# Altium schematic sheet DAC.SchDoc
size A4
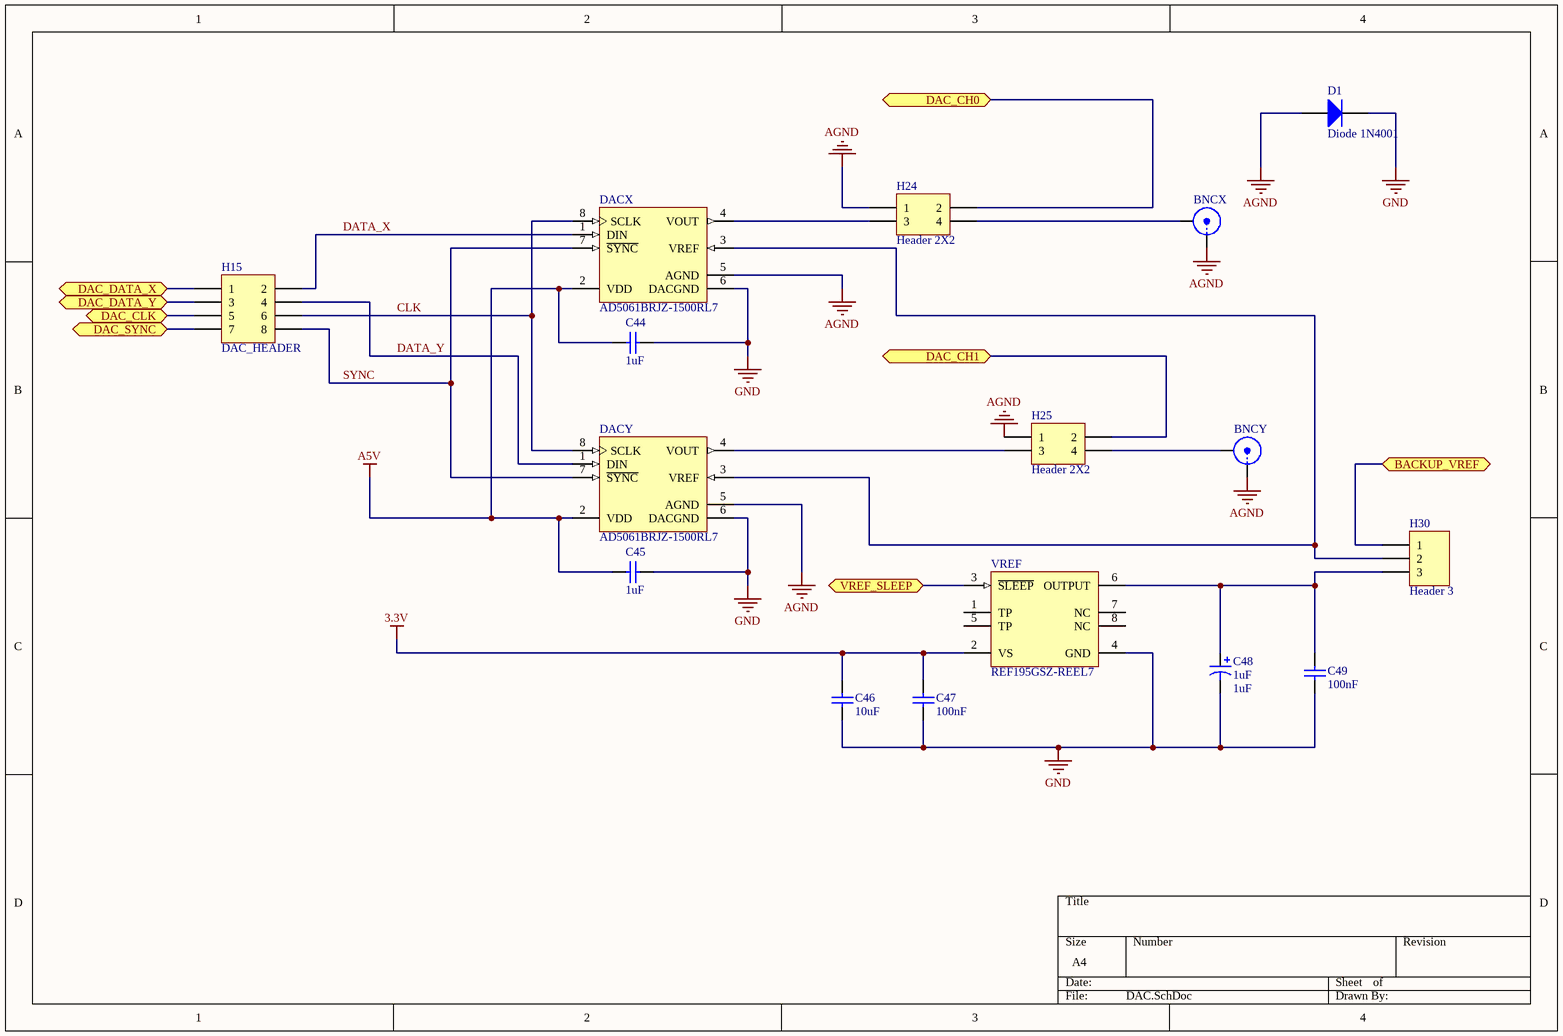
[diagram p0: DAC.SchDoc]

## Parts
BNCX  BNC  [BNC_RA CON]  (value not drawn)
BNCY  BNC  [BNC_RA CON]  (value not drawn)
C44  1uF  [CAPC0603(1608)100_M]
C45  1uF  [CAPC0603(1608)100_M]
C46  10uF  [CAPC0603(1608)100_M]
C47  100nF  [CAPC0603(1608)100_M]
C48  1uF  [C0805]
C49  100nF  [CAPC0603(1608)100_M]
D1  Diode 1N4001  [DO-41]
DACX  AD5061BRJZ-1500RL7  [RJ-8_N]
DACY  AD5061BRJZ-1500RL7  [RJ-8_N]
H15  DAC_HEADER  [HDR2X4]
H24  Header 2X2  [HDR2X2]
H25  Header 2X2  [HDR2X2]
H30  Header 3  [HDR1X3]
VREF  REF195GSZ-REEL7  [ADI-R-8_N]

## Ports
BACKUP_VREF, DAC_CH0, DAC_CH1, DAC_CLK, DAC_DATA_X, DAC_DATA_Y, DAC_SYNC, VREF_SLEEP

## Nets
3.3V: C46.2 C47.2 VREF.2(VS)
A5V: C44.1 C45.1 DACX.2(VDD) DACY.2(VDD)
AGND: BNCX.1(X) BNCY.1(X) D1.1(A) DACX.5(AGND) DACY.5(AGND) H24.1 H25.1
GND: C44.2 C45.2 C46.1 C47.1 C48.2 C49.1 D1.2(K) DACX.6(DACGND) DACY.6(DACGND) VREF.4(GND)
BACKUP_VREF: H30.1 ; port BACKUP_VREF
CLK: DACX.8(SCLK) DACY.8(SCLK) H15.6
DAC_CH0: H24.2 ; port DAC_CH0
DAC_CH1: H25.2 ; port DAC_CH1
DAC_CLK: H15.5 ; port DAC_CLK
DAC_DATA_X: H15.1 ; port DAC_DATA_X
DAC_DATA_Y: H15.3 ; port DAC_DATA_Y
DAC_SYNC: H15.7 ; port DAC_SYNC
DATA_X: DACX.1(DIN) H15.2
DATA_Y: DACY.1(DIN) H15.4
SYNC: DACX.7(~{SYNC}) DACY.7(~{SYNC}) H15.8
VREF_SLEEP: VREF.3(~{SLEEP}) ; port VREF_SLEEP
NetBNCX_2: BNCX.2(Y) H24.4
NetBNCY_2: BNCY.2(Y) H25.4
NetC48_1: C48.1 C49.2 H30.3 VREF.6(OUTPUT)
NetDACX_3: DACX.3(VREF) DACY.3(VREF) H30.2
NetDACX_4: DACX.4(VOUT) H24.3
NetDACY_4: DACY.4(VOUT) H25.3

Not connected (* = marked no-connect by the designer): VREF 1(TP) 5(TP) 7(NC) 8(NC)

## Library data of the parts
BNCX BNCY = BNC: BNC Elbow Connector; LatestRevisionDate: 17-Jul-2002; LatestRevisionNote: Re-released for DXP Platform.; Publisher: Altium Limited
C44-C47 C49 = CMP-1035-00001-1: CAP 0.5pF 10V Â±0.1pF 0603 (1608 Metric) Thickness 1mm SMD; Case-EIA: 0603; Case-Metric: 1608; Max Thickness: 1 mm; Tolerance: Â±0.1pF; Technology: SMT; Rated Voltage: 10 V
  C44 C45: Value: 1uF
  C46: Value: 10uF
  C47 C49: Value: 100nF
C48 = Cap Pol3: Polarized Capacitor (Surface Mount); Published: 8-Jun-2000; LatestRevisionDate: 29-May-2009; LatestRevisionNote: IPC-7351 Footprint Added.; PackageReference: C0805; Publisher: Altium Limited; PackageDescription: Chip Capacitor; Value: 1uF
D1 = Diode 1N4001: 1 Amp General Purpose Rectifier; Published: 8-Jun-2000; LatestRevisionDate: 17-Jul-2002; LatestRevisionNote: Re-released for DXP Platform.; DatasheetVersion: 1998; PackageVersion: Aug-1999; PackageReference: DO-41; Publisher: Altium Limited; PackageDescription: Diode, Axial; Body 5.2 x 2.7 mm (LxDia. max), Lead Dia. 0.86 mm (max); Code_JEDEC: DO-204-AL; ComponentLink1Description: Manufacturer Link; ComponentLink1URL: http://www.fairchildsemi.com/; ComponentLink2Description: Datasheet; ComponentLink2URL: http://www.fairchildsemi.com/ds/1N%2F1N4001.pdf
DACX DACY = AD5061BRJZ-1500RL7: Single 16-Bit Voltage Output nanoDAC with SPI Interface, 2.7 to 5.5 V, -40 to +85 degC, RJ-8, Pb-Free, Reel; Generic Part Number: AD5061; Manufacturer: Analog Devices; # DAC Outputs: 1; Max V+: 5.5V; Op Pwr Diss: 5mW; Resolution (Bits): 16; Settling Time: 4µs; Single Supply: Yes; DatasheetVersion: Rev.B; PackageVersion: 121608-A; PackageReference: RJ-8; PackageDescription: 8-Lead Thin Small Outline Transistor Package [SOT-23]; Supplier 1: Digi-Key; Supplier Part Number 1: AD5061BRJZ-1500RL7TR-ND; Supplier 2: Digi-Key; Supplier Part Number 2: AD5061BRJZ-1500RL7CT-ND; Supplier 3: Digi-Key; Supplier Part Number 3: AD5061BRJZ-1500RL7DKR-ND; Supplier 4: Farnell; Supplier Part Number 4: 2067828; Supplier 5: Newark; Supplier Part Number 5: 72T0896; Supplier 6: Mouser; Supplier Part Number 6: 584-AD5061BRJZ1500R7; Packing: Reel; RoHS: Y; Mounting Technology: Surface Mount; Code_JEDEC: MO-178-BA; PartNumber: AD5061BRJZ-1500RL7; ComponentLink1Description: Manufacturer URL; ComponentLink1URL: http://www.analog.com/en/index.html; ComponentLink2Description: Datasheet; ComponentLink2URL: http://www.analog.com/static/imported-files/data_sheets/AD5061.pdf; ComponentLink3Description: Package Specification; ComponentLink3URL: http://www.analog.com/static/imported-files/packages/PKG_PDF/SOT-23(RJ)/RJ_8.pdf; ComponentLink4Description: Product URL; ComponentLink4URL: http://www.analog.com/en/digital-to-analog-converters/da-converters/ad5061/products/product.html
H15 = Header 4X2: Header, 4-Pin, Dual row; LatestRevisionDate: 17-Jul-2002; LatestRevisionNote: Re-released for DXP Platform.; Publisher: Altium Limited
H24 H25 = Header 2X2: Header, 2-Pin, Dual row; LatestRevisionDate: 17-Jul-2002; LatestRevisionNote: Re-released for DXP Platform.; Publisher: Altium Limited
H30 = Header 3: Header, 3-Pin; LatestRevisionDate: 17-Jul-2002; LatestRevisionNote: Re-released for DXP Platform.; Publisher: Altium Limited
VREF = REF195GSZ-REEL7: Precision Micropower, Low Dropout Voltage Reference, 5 V Output, 5.1 to 15 V Supply, Industrial, 8-pin SOIC (R-8), Reel; Manufacturer: Analog Devices; Ref Out TC (ppm/C): 10; Vout: 5V; DatasheetVersion: Rev. L; PackageVersion: 060506-A, 06/2006; PackageReference: R-8; PackageDescription: 8-Pin Standard Small Outline Package, Body 4.9 x 3.9 mm, Pitch 1.27 mm; Supplier 1: Digi-Key; Supplier Part Number 1: REF195GSZ-REEL7TR-ND; Supplier 2: Digi-Key; Supplier Part Number 2: REF195GSZ-REEL7CT-ND; Supplier 3: Digi-Key; Supplier Part Number 3: REF195GSZ-REEL7DKR-ND; Supplier 4: Newark; Supplier Part Number 4: 59K9054; Supplier 5: Mouser; Supplier Part Number 5: 584-REF195GSZ-R7; Packing: Reel; Operating Temp Range: -40 to 85 degC; Mounting Technology: Surface Mount; Code_JEDEC: MS-012-AA; PartNumber: REF195GSZ-REEL7; ComponentLink1Description: Manufacturer URL; ComponentLink1URL: http://www.analog.com/en/index.html; ComponentLink2Description: Datasheet; ComponentLink2URL: http://www.analog.com/static/imported-files/data_sheets/REF19xSeries.pdf; ComponentLink3Description: Package Specification; ComponentLink3URL: http://www.analog.com/static/imported-files/packages/PKG_PDF/SOIC_Narrow%20(R)/R_8.pdf; ComponentLink4Description: URL Link1; ComponentLink4URL: Product URL:http://www.analog.com/en/special-linear-functions/voltage-references/ref195/products/product.html